# Altium schematic sheet Sinalização_Official.SchDoc
size A4; SheetNumber: 1; SheetTotal: 4
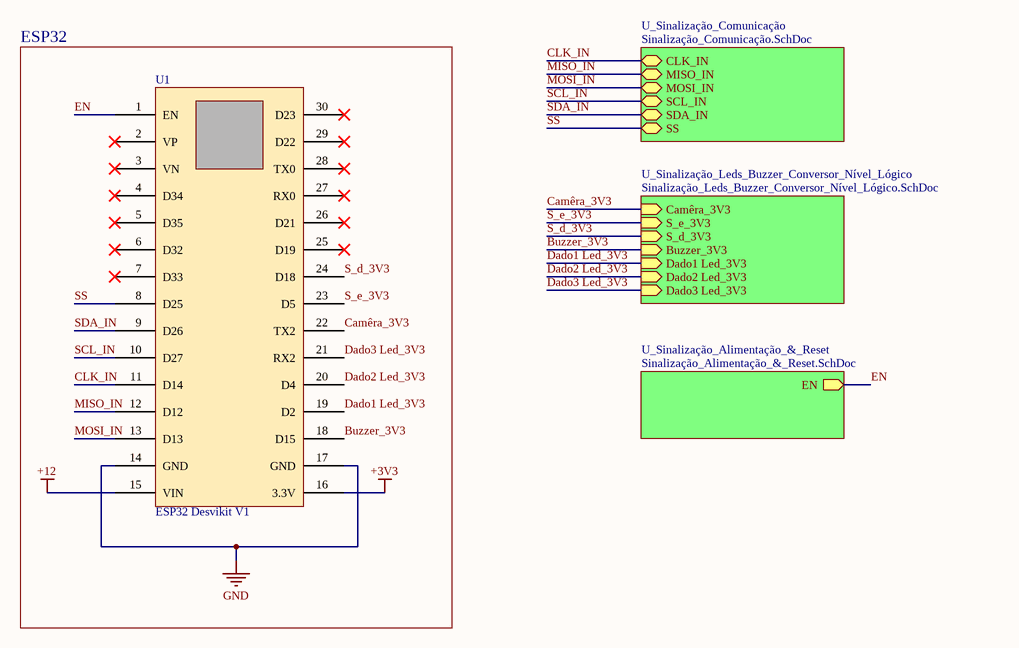
[diagram p0: Sinalização_Official.SchDoc]

## Parts
U1  value ESP32 Desvikit V1  [ESP32_Desvikit_v1]  (hidden comment: microcontrolador)

## Blocks framed on the sheet
ESP32: U1

## Sub-sheets
U_Sinalização_Alimentação_&_Reset = Sinalização_Alimentação_&_Reset.SchDoc: EN (out)
U_Sinalização_Comunicação = Sinalização_Comunicação.SchDoc: CLK_IN (bidir), MISO_IN (bidir), MOSI_IN (bidir), SCL_IN (bidir), SDA_IN (bidir), SS (bidir)
U_Sinalização_Leds_Buzzer_Conversor_Nível_Lógico = Sinalização_Leds_Buzzer_Conversor_Nível_Lógico.SchDoc: Dado3 Led_3V3 (in), Dado2 Led_3V3 (in), Dado1 Led_3V3 (in), Buzzer_3V3 (in), Camêra_3V3 (in), S_e_3V3 (in), S_d_3V3 (in)

## Nets
+3V3: U1.16(3.3V)
+12: U1.15(VIN)
GND: U1.14(GND) U1.17(GND)
Buzzer_3V3: U1.18(D15) ; sheet U_Sinalização_Leds_Buzzer_Conversor_Nível_Lógico/Buzzer_3V3
Camêra_3V3: U1.22(TX2) ; sheet U_Sinalização_Leds_Buzzer_Conversor_Nível_Lógico/Camêra_3V3
CLK_IN: U1.11(D14) ; sheet U_Sinalização_Comunicação/CLK_IN
Dado1 Led_3V3: U1.19(D2) ; sheet U_Sinalização_Leds_Buzzer_Conversor_Nível_Lógico/Dado1 Led_3V3
Dado2 Led_3V3: U1.20(D4) ; sheet U_Sinalização_Leds_Buzzer_Conversor_Nível_Lógico/Dado2 Led_3V3
Dado3 Led_3V3: U1.21(RX2) ; sheet U_Sinalização_Leds_Buzzer_Conversor_Nível_Lógico/Dado3 Led_3V3
EN: U1.1(EN) ; sheet U_Sinalização_Alimentação_&_Reset/EN
MISO_IN: U1.12(D12) ; sheet U_Sinalização_Comunicação/MISO_IN
MOSI_IN: U1.13(D13) ; sheet U_Sinalização_Comunicação/MOSI_IN
S_d_3V3: U1.24(D18) ; sheet U_Sinalização_Leds_Buzzer_Conversor_Nível_Lógico/S_d_3V3
S_e_3V3: U1.23(D5) ; sheet U_Sinalização_Leds_Buzzer_Conversor_Nível_Lógico/S_e_3V3
SCL_IN: U1.10(D27) ; sheet U_Sinalização_Comunicação/SCL_IN
SDA_IN: U1.9(D26) ; sheet U_Sinalização_Comunicação/SDA_IN
SS: U1.8(D25) ; sheet U_Sinalização_Comunicação/SS

Not connected (* = marked no-connect by the designer): U1 2(VP)* 3(VN)* 4(D34)* 5(D35)* 6(D32)* 7(D33)* 25(D19)* 26(D21)* 27(RX0)* 28(TX0)* 29(D22)* 30(D23)*

## Library data of the parts
U1 = ESP32 Desvikit v1: microcontrolador com moculo bluethoth e wifi